# EAGLE design control_board (EAGLE 6.5.0)
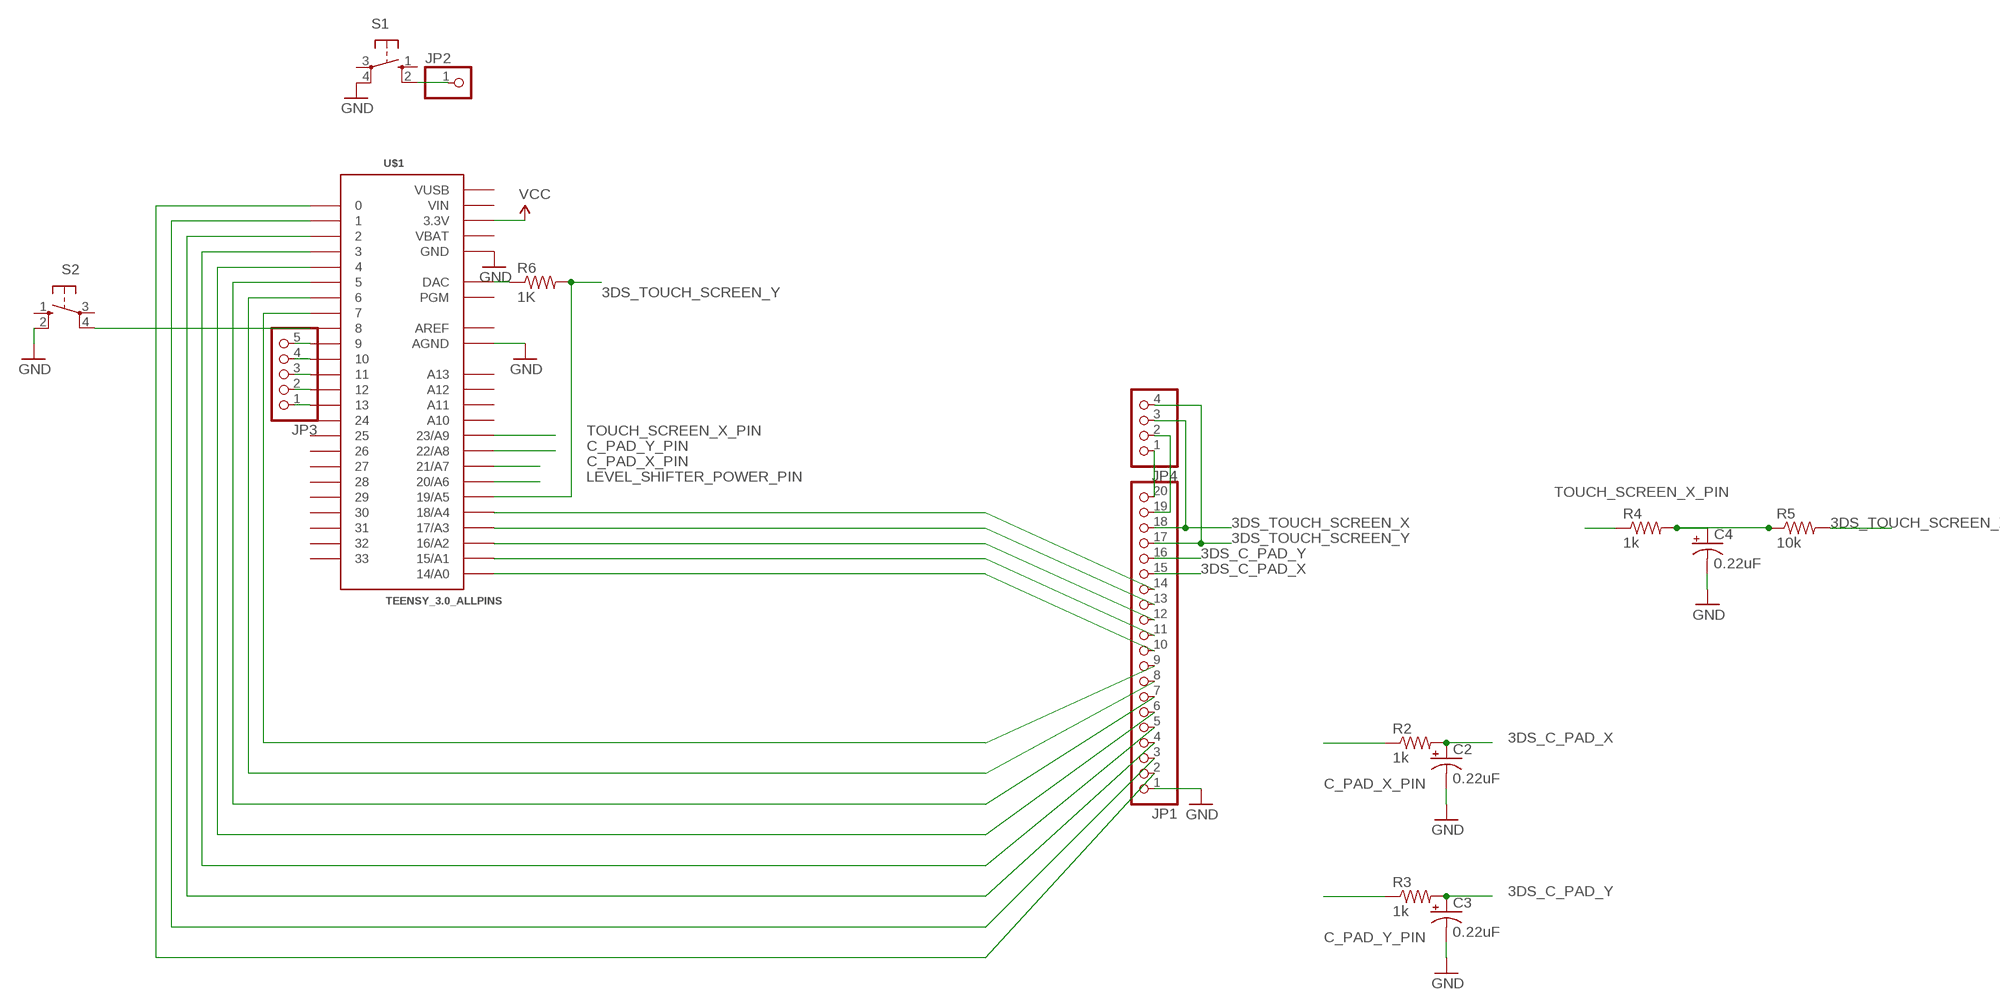
[diagram p0: schematic, sheet 1]

## Parts
C2  0.22uF  10UF-25V-20%(PTH)  [CPOL-RADIAL-10UF-25V]
C3  0.22uF  10UF-25V-20%(PTH)  [CPOL-RADIAL-10UF-25V]
C4  0.22uF  10UF-25V-20%(PTH)  [CPOL-RADIAL-10UF-25V]
JP1  PINHD-1X20  [1X20]
JP2  PINHD-1X1  [1X01]
JP3  PINHD-1X5  [1X05]
JP4  PINHD-1X4  [1X04]
R2  1k  R-US_0207/7  [0207/7]
R3  1k  R-US_0207/7  [0207/7]
R4  1k  R-US_0207/7  [0207/7]
R5  10k  RESISTORPTH-1/4W-VERT  [AXIAL-0.1]
R6  1K  R-US_0207/7  [0207/7]
S1  10-XX  [B3F-10XX]
S2  10-XX  [B3F-10XX]
U$1  TEENSY_3.0_ALLPINS  [TEENSY_3.0_ALLPINS]

## Nets
3DS_C_PAD_X: C2.1(+) JP1.15 R2.2
3DS_C_PAD_Y: C3.1(+) JP1.16 R3.2
3DS_TOUCH_SCREEN_X: JP1.18 JP4.3 R5.P$2
3DS_TOUCH_SCREEN_Y: JP1.17 JP4.4 R6.2 U$1.19/A5
C_PAD_X_PIN: R2.1 U$1.21/A7
C_PAD_Y_PIN: R3.1 U$1.22/A8
GND: C2.2(-) C3.2(-) C4.2(-) JP1.1 S1.4(P1) S2.2(S1) U$1.AGND U$1.GND U$1.GND1(GND) U$1.GND2(GND)
LEVEL_SHIFTER_POWER_PIN: U$1.20/A6
N0: C4.1(+) R4.2 R5.P$1
N$14: JP2.1 S1.2(S1)
N$15: JP1.10 U$1.14/A0
N$16: JP1.11 U$1.15/A1
N$17: JP1.12 U$1.16/A2
N$18: JP1.13 U$1.17/A3
N$19: JP1.2 U$1.0
N$20: JP1.3 U$1.1
N$21: JP1.4 U$1.2
N$22: JP1.5 U$1.3
N$23: JP1.6 U$1.4
N$24: JP1.7 U$1.5
N$25: JP1.8 U$1.6
N$26: JP1.9 U$1.7
N$27: R6.1 U$1.RESET(DAC)
N$28: JP1.14 U$1.18/A4
N$29: JP3.5 U$1.9
N$30: JP3.4 U$1.10
N$31: JP3.3 U$1.11
N$32: JP3.2 U$1.12
N$33: JP3.1 U$1.13
N$34: JP1.20 JP4.1
N$35: JP1.19 JP4.2
N$36: S2.4(P1) U$1.8
TOUCH_SCREEN_X_PIN: R4.1 U$1.23/A9
VCC: U$1.3.3V U$1.3.3V1(3.3V) U$1.3.3V2(3.3V)
Unconnected: S1.1(S) S1.3(P) S2.1(S) S2.3(P) U$1.24 U$1.25 U$1.26 U$1.27 U$1.28 U$1.29 U$1.30 U$1.31 U$1.32 U$1.33 U$1.A10 U$1.A11 U$1.A12 U$1.A13 U$1.PGM

## Power pins joined to a net without a drawn wire
AREF: U$1.AREF
VBAT: U$1.VBAT
VIN: U$1.VIN
VUSB: U$1.VUSB

## Library data of the parts
C2-C4 = SparkFun-Capacitors:10UF-25V-20%(PTH): CAP-08440; PROD_ID: CAP-08440
JP1 = pinhead:PINHD-1X20: PIN HEADER
JP2 = pinhead:PINHD-1X1: PIN HEADER
JP3 = pinhead:PINHD-1X5: PIN HEADER
JP4 = pinhead:PINHD-1X4: PIN HEADER
R2-R4 = resistor:R-US_: RESISTOR, American symbol
R5 = SparkFun-Resistors:RESISTOR: Resistor Basic schematic elements and footprints for 0603, 1206, and PTH resistors.
R6 = rcl:R-US_: RESISTOR, American symbol
S1 S2 = switch-omron:10-XX: OMRON SWITCH; MPN: B3F-1000; OC_FARNELL: 176432; OC_NEWARK: 36M3542
U$1 = Teensy3.0:TEENSY_3.0_ALLPINS: Teensy 3.0 with all pin holes and optional SMD-mount unshrouded header on bottom of Teensy 3.0. For more basic versions, see 'Basic', '+4' and 'AllAnalogPins'. Requires the installation of a un-shrouded SMD header on the underside of the Teensy 3.0

## Board
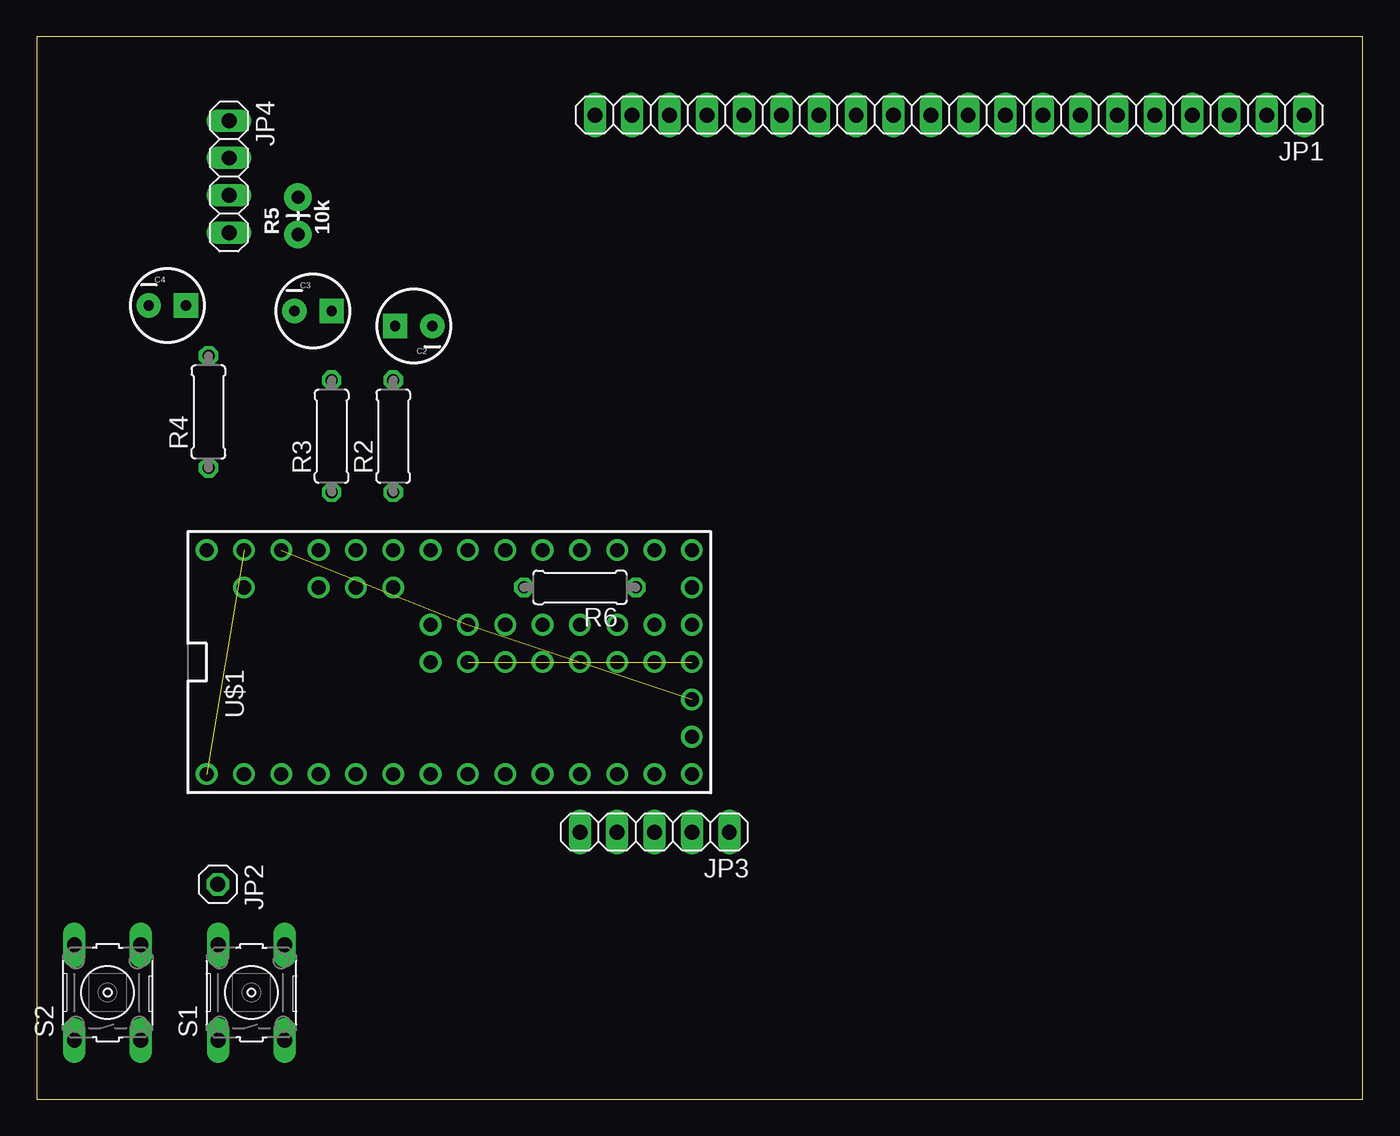
[diagram p1: board, top side]
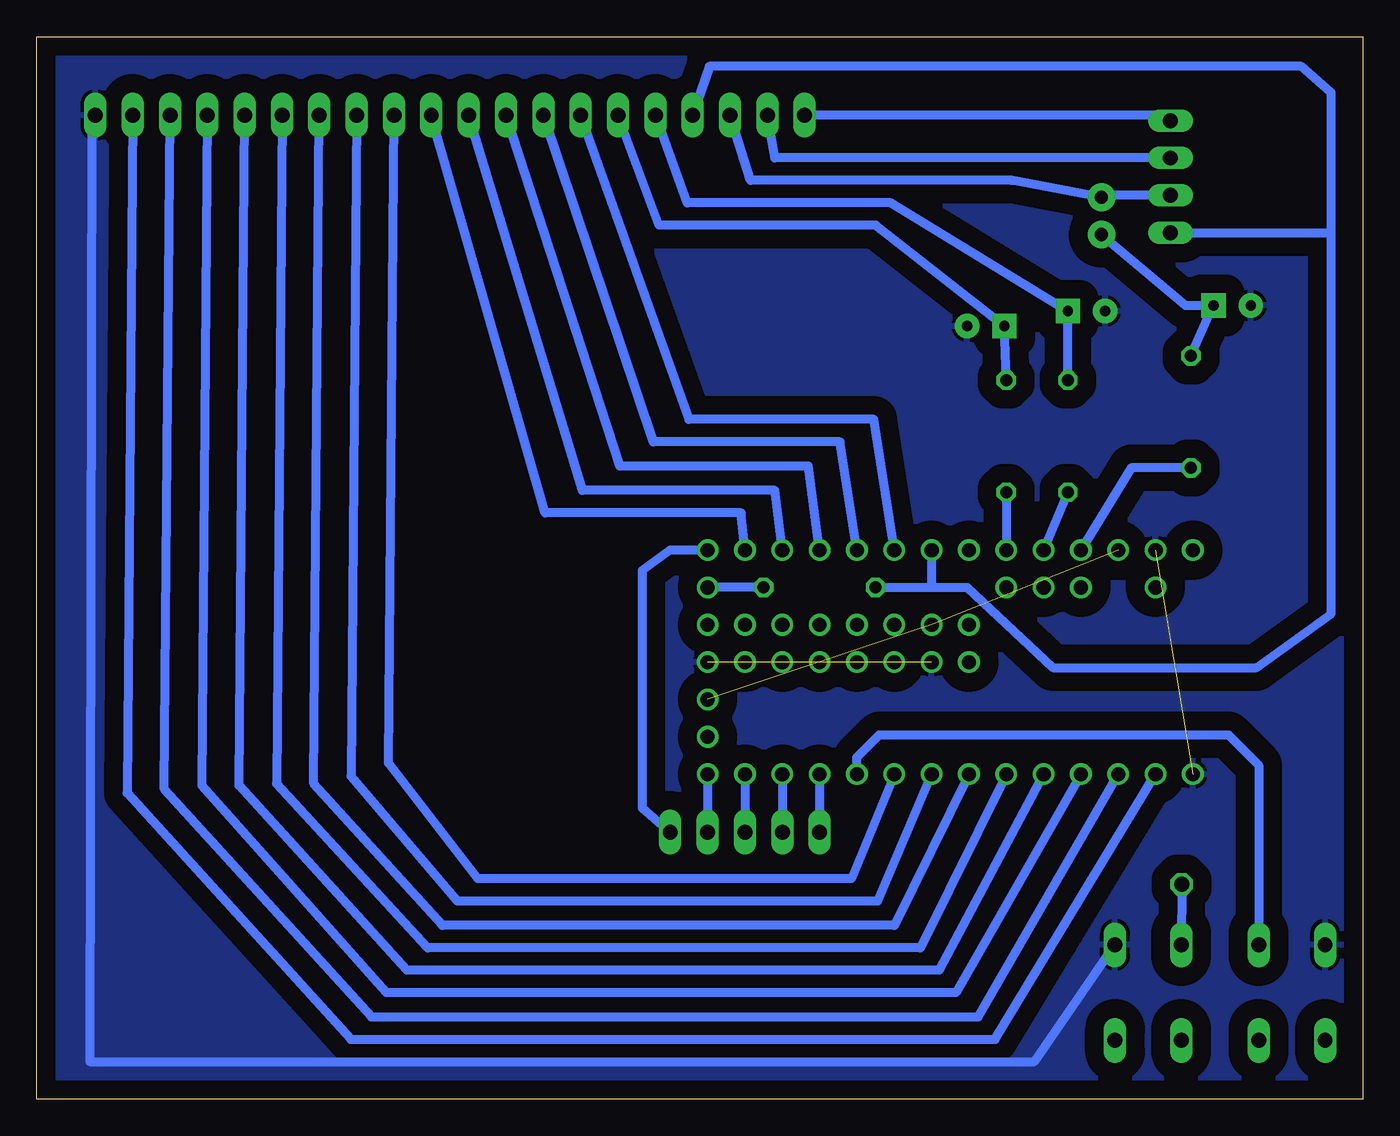
[diagram p2: board, bottom side, seen from below]

Size 90.22 x 72.25 mm. Coordinates in mm from the lower left corner, seen from the top.
Outline: 0,0 90.22,0 90.22,72.25 0,72.25 0,0
Copper layers (1*16): Top 0.035mm / dielectric 1.5mm / Bottom 0.035mm
Design rules "default": minimum track width 10mil, minimum drill 24mil, track to track 8mil, track to pad 8mil, pad to pad 8mil, via to via 8mil, smd to smd 8mil, copper to edge 40mil, drill to drill 8mil, minimum pad ring 10mil, minimum via ring 8mil, stop-mask expansion 4mil, vias tented up to drill 0mil, thermal gap 10mil

### Footprints (pad centres in the part's own frame; a part is rotated, then mirrored left to right if it is on the bottom)
CPOL-RADIAL-10UF-25V = drill 0.7 pad 1.651 square: 1 1.27,0 | drill 0.7 pad 1.651: 2 -1.27,0
1X20 = drill 1.016 long: 1 -24.13,0; 2 -21.59,0; 3 -19.05,0; 4 -16.51,0; 5 -13.97,0; 6 -11.43,0; 7 -8.89,0; 8 -6.35,0; 9 -3.81,0; 10 -1.27,0; 11 1.27,0; 12 3.81,0; 13 6.35,0; 14 8.89,0; 15 11.43,0; 16 13.97,0; 17 16.51,0; 18 19.05,0; 19 21.59,0; 20 24.13,0
1X01 = drill 1.016 octagon: 1 0,0
1X05 = drill 1.016 long: 1 -5.08,0; 2 -2.54,0; 3 0,0; 4 2.54,0; 5 5.08,0
1X04 = drill 1.016 long: 1 -3.81,0; 2 -1.27,0; 3 1.27,0; 4 3.81,0
0207/7 = drill 0.813 octagon: 1 -3.81,0; 2 3.81,0
AXIAL-0.1 = drill 0.9 pad 1.88: P$1 0,0; P$2 2.54,0
B3F-10XX = drill 1.016 long: 1 -3.251,2.261; 2 3.251,2.261; 3 -3.251,-2.261; 4 3.251,-2.261
TEENSY_3.0_ALLPINS = drill 0.965: 0 -7.62,13.97; 1 -7.62,11.43; 2 -7.62,8.89; 3 -7.62,6.35; 3.3V 7.62,11.43; 3.3V1 -2.54,-16.51; 3.3V2 2.54,-1.27; 4 -7.62,3.81; 5 -7.62,1.27; 6 -7.62,-1.27; 7 -7.62,-3.81; 8 -7.62,-6.35; 9 -7.62,-8.89; 10 -7.62,-11.43; 11 -7.62,-13.97; 12 -7.62,-16.51; 13 7.62,-16.51; 14/A0 7.62,-13.97; 15/A1 7.62,-11.43; 16/A2 7.62,-8.89; 17/A3 7.62,-6.35; 18/A4 7.62,-3.81; 19/A5 7.62,-1.27; 20/A6 7.62,1.27; 21/A7 7.62,3.81; 22/A8 7.62,6.35; 23/A9 7.62,8.89; 24 0,-3.81; 25 0,-6.35; 26 0,-8.89; 27 0,-11.43; 28 0,-13.97; 29 2.54,-13.97; 30 2.54,-11.43; 31 2.54,-8.89; 32 2.54,-6.35; 33 2.54,-3.81; A10 5.08,6.35; A11 5.08,3.81; A12 0,1.27; A13 2.54,1.27; AGND 7.62,13.97; AREF 5.08,8.89; GND -7.62,16.51; GND1 0,-16.51; GND2 0,-1.27; PGM 2.54,-16.51; RESET 5.08,-16.51; VBAT -5.08,-16.51; VIN 7.62,16.51; VUSB 5.08,13.97

### Placement (x,y rotation side)
C2  25.65,52.58 180 top
C3  18.8,53.59 0 top
C4  8.89,53.98 0 top
JP1  62.1,66.93 180 top
JP2  12.32,14.61 270 top
JP3  42.04,18.16 180 top
JP4  13.08,62.74 270 top
R2  24.26,45.09 90 top
R3  20.07,45.09 90 top
R4  11.68,46.74 90 top
R5  17.78,58.8 90 top
R6  36.96,34.8 180 top
S1  14.61,7.24 90 top
S2  4.83,7.24 90 top
U$1  28.07,29.72 90 top

### Tracks (layer width: path | path; a pad name or v marks a point on that pad's centre or on a via)
3DS_C_PAD_X
  Bottom 0.61: R2.2 C2.1 33.15,59.44 47.88,59.44 JP1.15
3DS_C_PAD_Y
  Bottom 0.61: JP1.16 45.97,60.96 32.13,60.96 C3.1 R3.2
3DS_TOUCH_SCREEN_X
  Bottom 0.61: JP1.18 41.66,62.48 23.88,62.48 R5.P$2 17.65,61.47 JP4.3
3DS_TOUCH_SCREEN_Y
  Bottom 0.61: 2.16,58.8 2.16,33.02 7.24,29.34 21.08,29.34 26.92,34.8 29.34,34.8 | 2.16,58.8 2.16,68.45 4.19,70.23 44.45,70.23 JP1.17 | JP4.4 2.29,58.93 2.16,58.8 | R6.2 29.34,34.8 | U$1.19/A5 29.34,34.8
C_PAD_X_PIN
  Bottom 0.61: R2.1 U$1.21/A7
C_PAD_Y_PIN
  Bottom 0.61: R3.1 U$1.22/A8
GND  (2 unrouted)
  Bottom 0.61: JP1.1 86.49,66.93 86.61,2.54 22.35,2.54 S1.4
  pour Bottom (isolate 1.27): -0.13,72.64 0,0 90.3,0.13 90.17,72.77
N0
  Bottom 0.61: R4.2 C4.1 12.06,53.98 R5.P$1
N$14
  Bottom 0.61: JP2.1 S1.2
N$15
  Bottom 0.61: U$1.14/A0 42.29,39.88 55.63,39.88 JP1.10
N$16
  Bottom 0.61: U$1.15/A1 40.01,41.4 53.09,41.4 JP1.11
N$17
  Bottom 0.61: U$1.16/A2 37.72,43.05 50.55,43.05 JP1.12
N$18
  Bottom 0.61: U$1.17/A3 35.56,44.7 48.26,44.7 JP1.13
N$19
  Bottom 0.61: U$1.0 25.02,4.06 68.83,4.06 84.07,20.83 JP1.2
N$20
  Bottom 0.61: U$1.1 26.16,5.59 67.44,5.59 81.53,21.08 JP1.3
N$21
  Bottom 0.61: U$1.2 27.69,7.24 66.42,7.24 78.99,21.34 JP1.4
N$22
  Bottom 0.61: U$1.3 28.83,8.76 65.02,8.76 76.45,21.34 JP1.5
N$23
  Bottom 0.61: U$1.4 30.1,10.29 63.63,10.29 73.91,21.46 JP1.6
N$24
  Bottom 0.61: U$1.5 31.88,11.81 62.61,11.81 71.37,21.46 JP1.7
N$25
  Bottom 0.61: U$1.6 33.02,13.46 61.59,13.46 68.83,21.97 JP1.8
N$26
  Bottom 0.61: U$1.7 34.8,14.99 60.2,14.99 66.29,22.86 JP1.9
N$27
  Bottom 0.61: R6.1 U$1.RESET
N$28
  Bottom 0.61: U$1.18/A4 33.27,46.23 45.85,46.23 JP1.14
N$29
  Bottom 0.61: U$1.9 JP3.5
N$30
  Bottom 0.61: U$1.10 JP3.4
N$31
  Bottom 0.61: U$1.11 JP3.3
N$32
  Bottom 0.61: U$1.12 JP3.2
N$33
  Bottom 0.61: U$1.13 47.12,37.34 49.02,35.94 49.02,19.81 JP3.1
N$34
  Bottom 0.61: JP4.1 13.46,66.93 JP1.20
N$35
  Bottom 0.61: JP4.2 40.01,64.01 JP1.19
N$36
  Bottom 0.61: U$1.8 34.42,23.24 32.89,24.77 9.14,24.77 7.09,22.71 S2.4
TOUCH_SCREEN_X_PIN
  Bottom 0.61: R4.1 15.75,42.93 U$1.23/A9
VCC  (2 unrouted)